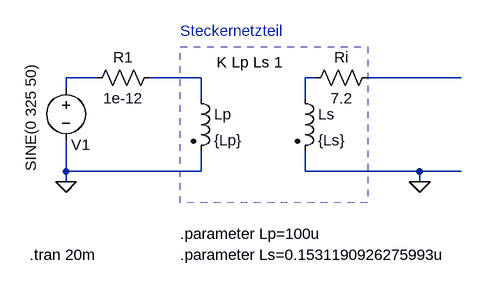
[diagram p0: schematic 100_lec_exercise_diode_transformer.asc]
100_lec_exercise_diode_transformer.asc, the LTspice schematic file:
Version 4
SHEET 1 2012 680
WIRE -48 48 -96 48
WIRE 112 48 32 48
WIRE 288 48 272 48
WIRE 512 48 368 48
WIRE -96 64 -96 48
WIRE 112 80 112 48
WIRE 272 80 272 48
WIRE -96 192 -96 144
WIRE 112 192 112 160
WIRE 112 192 -96 192
WIRE 272 192 272 160
WIRE 448 192 272 192
WIRE 512 192 448 192
WIRE -96 208 -96 192
WIRE 448 208 448 192
FLAG -96 208 0
FLAG 448 208 0
SYMBOL voltage -96 48 R0
WINDOW 0 8 103 Left 2
WINDOW 3 -54 144 VLeft 2
WINDOW 123 0 0 Left 2
WINDOW 39 0 0 Left 2
SYMATTR InstName V1
SYMATTR Value SINE(0 325 50)
SYMBOL ind2 96 64 R0
SYMATTR InstName Lp
SYMATTR Value {Lp}
SYMATTR Type ind
SYMBOL ind2 256 64 R0
SYMATTR InstName Ls
SYMATTR Value {Ls}
SYMATTR Type ind
SYMBOL res 48 32 R90
WINDOW 0 0 56 VBottom 2
WINDOW 3 32 56 VTop 2
SYMATTR InstName R1
SYMATTR Value 1e-12
SYMBOL res 384 32 R90
WINDOW 0 0 56 VBottom 2
WINDOW 3 32 56 VTop 2
SYMATTR InstName Ri
SYMATTR Value 7.2
TEXT 136 24 Left 2 !K Lp Ls 1
TEXT 80 -24 Left 2 ;Steckernetzteil
TEXT 80 288 Left 2 !.parameter Lp=100u
TEXT 80 320 Left 2 !.parameter Ls=0.1531190926275993u
TEXT -152 320 Left 2 !.tran 20m
RECTANGLE Normal 368 240 80 0 2

The netlist it stands for:
* 100_lec_exercise_diode_transformer.asc
V1 N001 0 SINE(0 325 50)
Lp N002 0 {Lp}
Ls N003 0 {Ls}
R1 N002 N001 1e-12
Ri N004 N003 7.2
K Lp Ls 1
* Steckernetzteil
.parameter Lp=100u
.parameter Ls=0.1531190926275993u
.tran 20m
.backanno
.end